# EAGLE design alim_2016 (EAGLE 7.5.0)
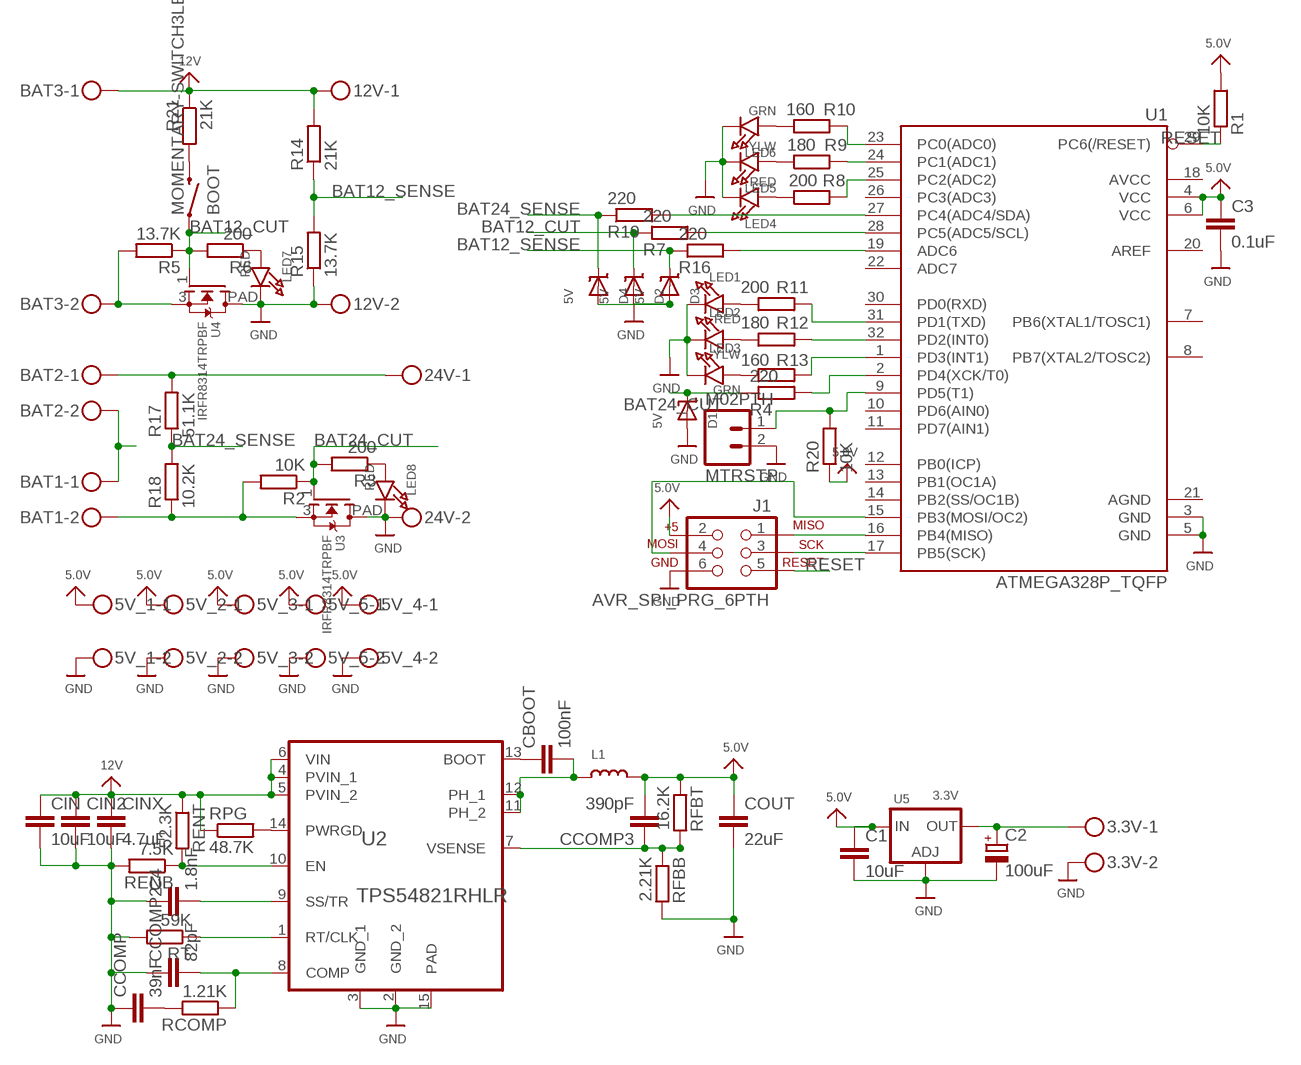
[diagram p0: schematic, sheet 1]

## Parts
3.3V  WURTH_2PIN311  [WURTH311]
5V_1  WURTH_2PIN311  [WURTH311]
5V_2  WURTH_2PIN311  [WURTH311]
5V_3  WURTH_2PIN311  [WURTH311]
5V_4  WURTH_2PIN311  [WURTH311]
5V_5  WURTH_2PIN311  [WURTH311]
12V  WURTH_2PIN311  [WURTH311]
24V  WURTH_2PIN311  [WURTH311]
BAT1  WURTH_2PIN313  [WURTH313_2]
BAT2  WURTH_2PIN313  [WURTH313_2]
BAT3  WURTH_2PIN313  [WURTH313_2]
BOOT  MOMENTARY-SWITCH3LEG  [3LEGGED-TACT]
C1  10uF  C-EUC0805  [C0805]
C2  100uF  CPOL-EUE2.5-7  [E2,5-7]
C3  0.1uF  C-EUC0805  [C0805]
C4  1.8nF  C-EUC0805  [C0805]
CBOOT  100nF  C-EUC0805  [C0805]
CCOMP  39nF  C-EUC0805  [C0805]
CCOMP2  82pF  C-EUC0805  [C0805]
CCOMP3  390pF  C-EUC0805  [C0805]
CIN  10uF  C-EUC0805  [C0805]
CIN2  10uF  C-EUC0805  [C0805]
CINX  4.7uF  C-EUC0805  [C0805]
COUT  22uF  C-EUC0805  [C0805]
D1  5V  DIODE-ZENERSOD123  [SOD-123]
D2  5V  DIODE-ZENERSOD123  [SOD-123]
D3  5V  DIODE-ZENERSOD123  [SOD-123]
D4  5V  DIODE-ZENERSOD123  [SOD-123]
J1  AVR_SPI_PRG_6PTH  [2X3]
L1  2.2uH  XAL5030  [XAL5030]
LED1  RED  LED0805_NOOUTLINE  [CHIPLED_0805_NOOUTLINE]
LED2  YLW  LED0805_NOOUTLINE  [CHIPLED_0805_NOOUTLINE]
LED3  GRN  LED0805_NOOUTLINE  [CHIPLED_0805_NOOUTLINE]
LED4  RED  LED0805_NOOUTLINE  [CHIPLED_0805_NOOUTLINE]
LED5  YLW  LED0805_NOOUTLINE  [CHIPLED_0805_NOOUTLINE]
LED6  GRN  LED0805_NOOUTLINE  [CHIPLED_0805_NOOUTLINE]
LED7  RED  LED0805_NOOUTLINE  [CHIPLED_0805_NOOUTLINE]
LED8  RED  LED0805_NOOUTLINE  [CHIPLED_0805_NOOUTLINE]
MTRSTP  M02PTH  [1X02]
R1  10K  R-EU_M0805  [M0805]
R2  10K  R-EU_M0805  [M0805]
R3  200  R-EU_M0805  [M0805]
R4  220  R-EU_M0805  [M0805]
R5  13.7K  R-EU_M0805  [M0805]
R6  200  R-EU_M0805  [M0805]
R7  220  R-EU_M0805  [M0805]
R8  200  R-EU_M0805  [M0805]
R9  180  R-EU_M0805  [M0805]
R10  160  R-EU_M0805  [M0805]
R11  200  R-EU_M0805  [M0805]
R12  180  R-EU_M0805  [M0805]
R13  160  R-EU_M0805  [M0805]
R14  21K  R-EU_M0805  [M0805]
R15  13.7K  R-EU_M0805  [M0805]
R16  220  R-EU_M0805  [M0805]
R17  51.1K  R-EU_M0805  [M0805]
R18  10.2K  R-EU_M0805  [M0805]
R19  220  R-EU_M0805  [M0805]
R20  10K  R-EU_M0805  [M0805]
R21  21K  R-EU_M0805  [M0805]
RCOMP  1.21K  R-EU_M0805  [M0805]
RENB  7.5K  R-EU_M0805  [M0805]
RENT  52.3K  R-EU_M0805  [M0805]
RFBB  2.21K  R-EU_M0805  [M0805]
RFBT  16.2K  R-EU_M0805  [M0805]
RPG  48.7K  R-EU_M0805  [M0805]
RT  59K  R-EU_M0805  [M0805]
U1  ATMEGA328P_TQFP  [TQFP32-08]
U2  TPS54821RHLR  [S-PVQFN-N14]
U3  IRFR8314TRPBF  [DPACK_1]
U4  IRFR8314TRPBF  [DPACK_1]
U5  3.3V  LM1117TO252  [TO252]

## Nets
5.0V: 5V_1.P$1 5V_2.P$1 5V_3.P$1 5V_4.P$1 5V_5.P$1 C1.1 C3.1 CCOMP3.2 COUT.1 J1.2 L1.2 R1.2 R20.1 RFBT.1 U1.4(VCC) U1.6(VCC) U5.2(IN)
12V: 12V.P$1 BAT3.P$1 CIN2.1 CIN.1 CINX.1 R14.2 R21.1 RENT.1 RPG.1 U2.4(PVIN_1) U2.5(PVIN_2) U2.6(VIN)
24V: 24V.P$1 BAT2.P$1 R17.2
BAT12_CUT: BOOT.1 D2.C R5.1 R6.2 R7.1 U4.1(G)
BAT12_SENSE: D3.C R14.1 R15.2 R16.1
BAT24_CUT: D1.C R2.1 R3.2 R4.1 U3.1(G)
BAT24_SENSE: D4.C R17.1 R18.2 R19.1
COMP: CCOMP2.2 RCOMP.1 U2.8(COMP)
EN: RENB.1 RENT.2 U2.10(EN)
GND: 3.3V.P$2 5V_1.P$2 5V_2.P$2 5V_3.P$2 5V_4.P$2 5V_5.P$2 12V.P$2 24V.P$2 C1.2 C2.- C3.2 C4.1 CCOMP2.1 CCOMP.1 CIN2.2 CIN.2 CINX.2 COUT.2 D1.A D2.A D3.A D4.A J1.6 LED1.C LED2.C LED3.C LED4.C LED5.C LED6.C LED7.C LED8.C MTRSTP.2 R15.1 RENB.2 RFBB.2 RT.2 U1.3(GND) U1.5(GND) U2.2(GND_2) U2.3(GND_1) U2.15(PAD) U3.PAD(D) U4.PAD(D) U5.1(ADJ)
MISO: J1.1 U1.16(PB4(MISO))
MOSI: J1.4 U1.15(PB3(MOSI/OC2))
N$1: 3.3V.P$1 C2.+ U5.3(OUT)
N$2: R16.2 U1.19(ADC6)
N$5: BAT1.P$1 BAT2.P$2
N$6: MTRSTP.1 R20.2 U1.9(PD5(T1))
N$7: BOOT.3 R21.2
N$8: BAT1.P$2 R2.2 R18.1 U3.3(S)
N$9: LED8.A R3.1
N$10: LED7.A R6.1
N$11: R4.2 U1.2(PD4(XCK/T0))
N$13: BAT3.P$2 R5.2 U4.3(S)
N$14: R9.2 U1.24(PC1(ADC1))
N$15: LED4.A R8.1
N$16: LED5.A R9.1
N$17: LED6.A R10.1
N$18: LED1.A R11.1
N$19: LED2.A R12.1
N$20: LED3.A R13.1
N$21: R8.2 U1.25(PC2(ADC2))
N$22: R10.2 U1.23(PC0(ADC0))
N$23: R7.2 U1.28(PC5(ADC5/SCL))
N$24: R13.2 U1.1(PD3(INT1))
N$25: R12.2 U1.32(PD2(INT0))
N$26: R11.2 U1.31(PD1(TXD))
N$28: R19.2 U1.27(PC4(ADC4/SDA))
N$30: CCOMP.2 RCOMP.2
N$31: CBOOT.1 U2.13(BOOT)
N$35: RPG.2 U2.14(PWRGD)
PH: CBOOT.2 L1.1 U2.11(PH_2) U2.12(PH_1)
RESET: J1.5 R1.1 U1.29(PC6(/RESET))
RTCLK: RT.1 U2.1(RT/CLK)
SCK: J1.3 U1.17(PB5(SCK))
SSTR: C4.2 U2.9(SS/TR)
VSENSE: CCOMP3.1 RFBB.1 RFBT.2 U2.7(VSENSE)
Unconnected: U1.7(PB6(XTAL1/TOSC1)) U1.8(PB7(XTAL2/TOSC2)) U1.10(PD6(AIN0)) U1.11(PD7(AIN1)) U1.12(PB0(ICP)) U1.13(PB1(OC1A)) U1.14(PB2(SS/OC1B)) U1.18(AVCC) U1.20(AREF) U1.21(AGND) U1.22(ADC7) U1.26(PC3(ADC3)) U1.30(PD0(RXD))

## Library data of the parts
3.3V 5V_1-5V_5 12V 24V BAT1-BAT3 = alim:WURTH_2PIN
BOOT = alim:MOMENTARY-SWITCH: Various NO switches- pushbuttons, reed, etc
C1 C3 C4 CBOOT CCOMP CCOMP2 CCOMP3 CIN CIN2 CINX COUT = rcl:C-EU: CAPACITOR, European symbol
C2 = rcl:CPOL-EU: POLARIZED CAPACITOR, European symbol
D1-D4 = alim:DIODE-ZENER: Zener Diode SMA: 30V 1W Zener Diode, 1.2Vf - Digikey: SMAZ30-FDICT-ND
J1 = SparkFun-Connectors:AVR_SPI_PRG_6: AVR ISP 6 Pin This is the reduced ISP connector for AVR programming. Common on Arduino. This footprint will take up less PCB space and can be used with a 10-pin to 6-pin adapter such as SKU: BOB-08508
L1 = alim:XAL5030
LED1-LED8 = microbuilder:LED: LED 0603 - 0603 Surface Mount Package 2mA: Green LED - Low Power (3.9mcd, 2ma, 1.7Vf) - Digikey: 475-2709-2-ND Orange LED - Low Power (9.8mcd, 2ma, 1.8Vf) - Digikey: 475-1194-2-ND Red LED - Low Power (5mcd, 2ma, 1.8Vf) - Digikey: 475-1195-2-ND Yellow LED - Low Power (7mcd, 2ma, 1.8Vf) - Digikey: 475-1196-2-ND 5mA: Blue LED - Low Power (17mcd, 5ma, 2.9Vf) - Digikey: LNJ937W8CRACT-ND 0805 - 0805 Surface Mount Package 2mA: Red LED (8.8mcd, 2mA, 1.8Vf, Clear) - Low Power [Digikey: 475-2510-1-ND] Green LED (5mcd, 2mA, 1.8Vf, Clear) - Low Power [Digikey: 475-2730-1-ND] Yellow LED (11.3mcd, 2mA, 1.8Vf, Clear) - Low Power [Digikey: 475-2555-1-ND] 20mA: Red LED (104mcd, 20mA, Diffused) - LS R976 [Digikey: 475-1278-6-ND] Red LED (12mcd, 20mA, 2.0Vf, Clear) - APT2012EC [Digikey: 754-1128-1-ND] Green LED (15mcd, 20mA, 2.2Vf, Clear) - APT2012GC [Digikey: 754-1131-1-ND] Orange LED (160mcd, 20mA, 2.1Vf, Clear) - APT2012SECK [Digikey: 754-1130-1-ND] 1206 - 1206 Surface Mount Package Green LED (26mcd, 20mA, Diffused) - LG N971 [Digikey: 475-1407-6-ND] Red LED (15mcd, 20mA, Diffused) - LH N974 [Digikey: 475-1416-6-ND]
MTRSTP = SparkFun-Connectors:M02: Standard 2-pin 0.1" header. Use with - straight break away headers ( PRT-00116) - right angle break away headers (PRT-00553) - swiss pins (PRT-00743) - machine pins (PRT-00117) - female headers (PRT-00115) Molex polarized connector foot print use with: PRT-08233 with associated crimp pins and housings. 2.54_SCREWTERM for use with PRT-10571. 3.5mm Screw Terminal footprints for PRT-08084 5mm Screw Terminal footprints for use with PRT-08433
R1-R21 RCOMP RENB RENT RFBB RFBT RPG RT = resistor:R-EU_: RESISTOR, European symbol
U1 = SparkFun-DigitalIC:ATMEGA328P_TQFP; PROD_ID: IC-09069
U2 = alim:TPS54821RHLR; DATASHEETURL: http://www.ti.com/product/tps54821; FREQUENCY: 1600000.0; IMAX: 8.0; MANUFACTURER_NAME: Texas Instruments; MANUFACTURER_PART_NUMBER: TPS54821RHLR; MKTG_PACKAGE: S-PVQFN-N14; NSID: TPS54821RHLR; PACKAGE: S-PVQFN-N14; VENDOR: Texas Instruments
U3 U4 = alim:IRFR8314TRPBF
U5 = microbuilder:LM1117: LM1117 Voltage Regulator LM1117 Adjustable Voltage regulator [Digikey: LM1117IMP-ADJDKR-ND] LM1117 3.3V Voltage regulator [AP1117E33GDIDKR-ND] LM1117 5.0V Voltage regulator [AP1117E50GDIDKR-ND] SOT223-REFLOW - SOT223 package for solder paste/reflow ovens SOT223-WAVE - SOT223 package for hand-soldering (larger pads) Note: For the fixed-voltage regulators, simply set the ADJ pin to GND.

## Board
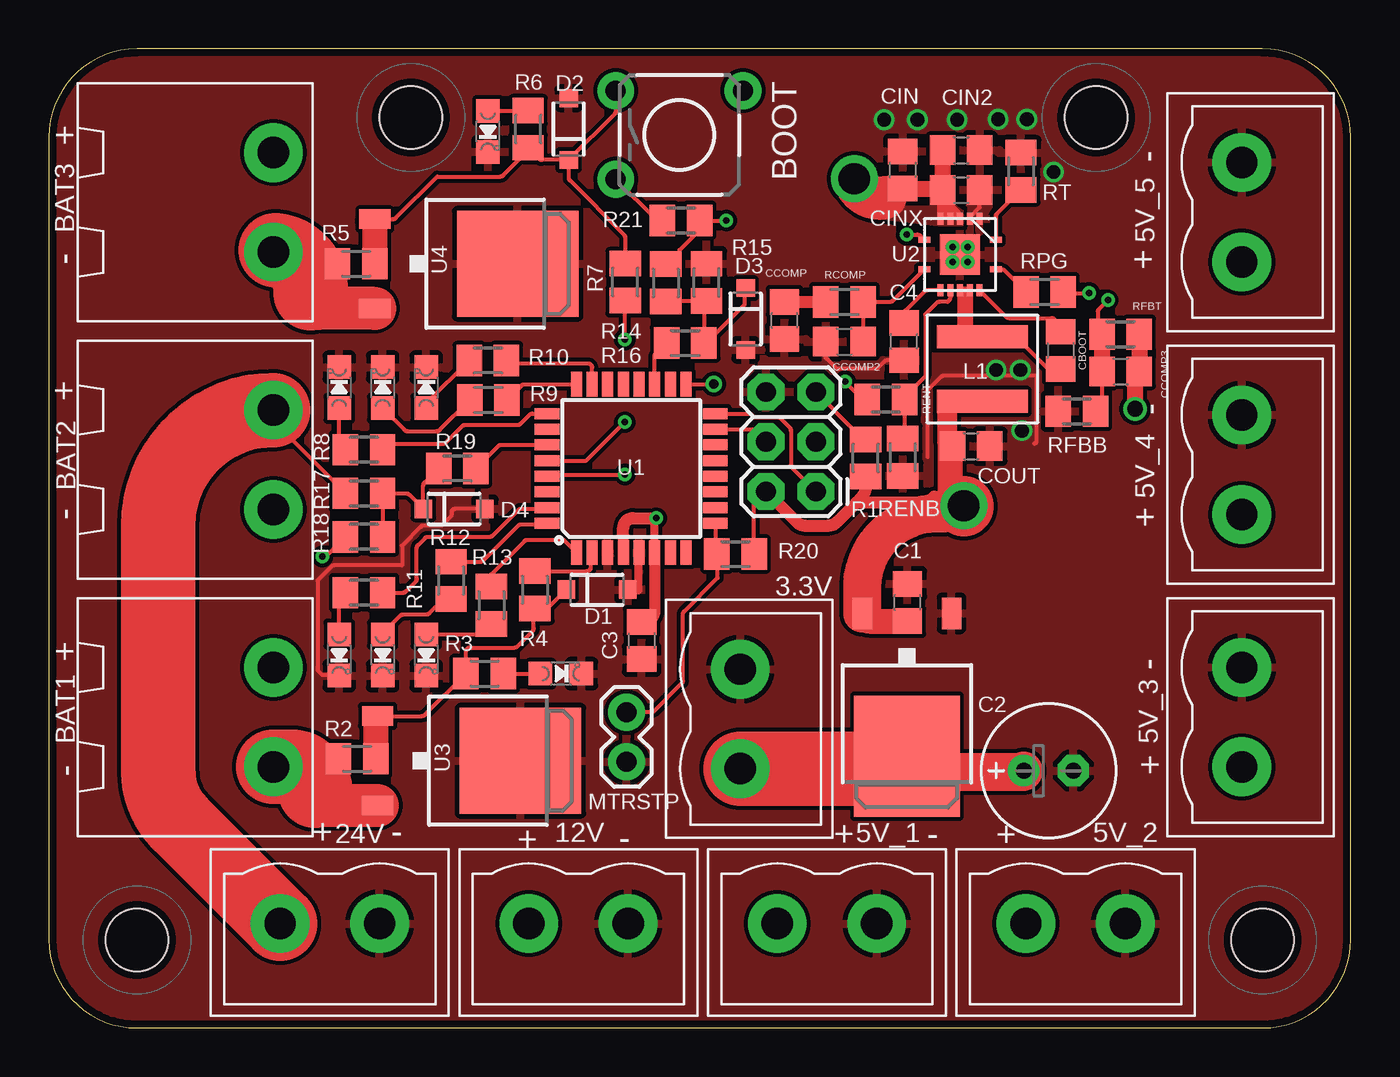
[diagram p1: board, top side]
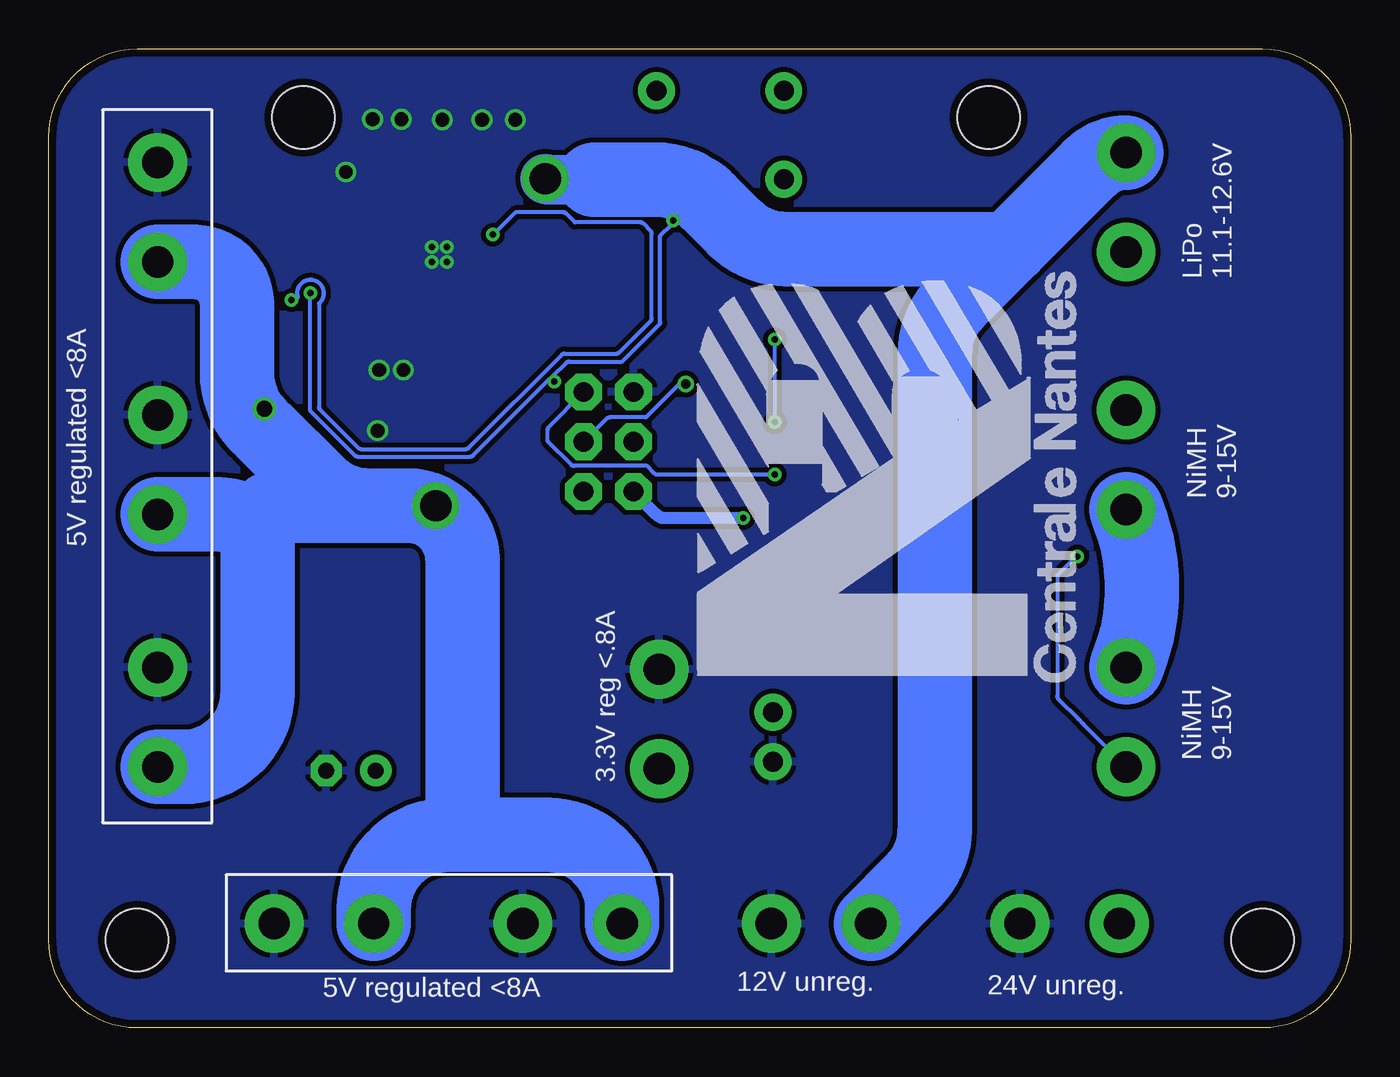
[diagram p2: board, bottom side, seen from below]

Size 66.5 x 50 mm. Coordinates in mm from the lower left corner, seen from the top.
Outline: 4.5,50 arc90 0,45.5 0,4.5 arc90 4.5,0 62,0 arc90 66.5,4.5 66.5,45.5 arc90 62,50 4.5,50
Copper layers (1*16): Top 0.0356mm / dielectric 1.5011mm / Bottom 0.0356mm
Design rules "oshpark *": minimum track width 6mil, minimum drill 13mil, track to track 6mil, track to pad 6mil, pad to pad 6mil, via to via 6mil, smd to smd 6mil, copper to edge 15mil, drill to drill 6mil, minimum pad ring 7mil, minimum via ring 7mil, stop-mask expansion 3mil, vias tented up to drill 35mil, thermal gap 10mil
Holes 3.2 mm at 4.5,4.5 62,4.5 53.5,46.5 18.5,46.5

### Footprints (pad centres in the part's own frame; a part is rotated, then mirrored left to right if it is on the bottom)
WURTH311 = drill 1.6 pad 3: P$1 -2.54,0; P$2 2.54,0
WURTH313_2 = drill 1.6 pad 3: P$1 -2.54,0; P$2 2.54,0
3LEGGED-TACT = drill 1.016 pad 1.88: 1 -3.251,2.261; 2 3.251,2.261; 3 -3.251,-2.261
C0805 = smd 1.3 x 1.5: 1 -0.95,0; 2 0.95,0
E2,5-7 = drill 0.813 pad 1.6: + -1.27,0 | drill 0.813 pad 1.6 octagon: - 1.27,0
SOD-123 = smd 0.9 x 0.95: A 1.575,0; C -1.575,0
2X3 = drill 1.016 pad 1.88 octagon: 1 0,0; 2 0,2.54; 3 2.54,0; 4 2.54,2.54; 5 5.08,0; 6 5.08,2.54
XAL5030 = smd 1.168 x 4.648: 1 -1.651,0; 2 1.651,0
CHIPLED_0805_NOOUTLINE = smd 1.2 x 1.2: A 0,-1.05; C 0,1.05
1X02 = drill 1.016 pad 1.88: 1 0,0; 2 2.54,0
M0805 = smd 1.3 x 1.6: 1 -0.95,0; 2 0.95,0
TQFP32-08 = smd 1.27 x 0.559: 1 -4.293,2.8; 2 -4.293,2; 3 -4.293,1.2; 4 -4.293,0.4; 5 -4.293,-0.4; 6 -4.293,-1.2; 7 -4.293,-2; 8 -4.293,-2.8; 17 4.293,-2.8; 18 4.293,-2; 19 4.293,-1.2; 20 4.293,-0.4; 21 4.293,0.4; 22 4.293,1.2; 23 4.293,2; 24 4.293,2.8 | smd 0.559 x 1.27: 9 -2.8,-4.293; 10 -2,-4.293; 11 -1.2,-4.293; 12 -0.4,-4.293; 13 0.4,-4.293; 14 1.2,-4.293; 15 2,-4.293; 16 2.8,-4.293; 25 2.8,4.293; 26 2,4.293; 27 1.2,4.293; 28 0.4,4.293; 29 -0.4,4.293; 30 -1.2,4.293; 31 -2,4.293; 32 -2.8,4.293
S-PVQFN-N14 = smd 0.305 x 0.61: 1 -0.75,1.825; 7 -0.75,-1.825; 8 0.75,-1.825; 14 0.75,1.825 | smd 0.61 x 0.305: 2 -1.825,1; 3 -1.825,0.5; 4 -1.825,0; 5 -1.825,-0.5; 6 -1.825,-1; 9 1.825,-1; 10 1.825,-0.5; 11 1.825,0; 12 1.825,0.5; 13 1.825,1 | smd 2.057 x 2.057: 15 0,0
DPACK_1 = smd 1 x 1.6: 1 -2.28,-4.8; 3 2.28,-4.8 | smd 5.4 x 6.2: PAD 0,2.5
TO252 = smd 1 x 1.6: 1 -2.28,-4.8; 2 2.28,-4.8 | smd 5.4 x 6.2: 3 0,2.5

### Placement (x,y rotation side)
3.3V  35.32,15.78 90 top
5V_1  39.75,5.33 0 top
5V_2  52.45,5.33 0 top
5V_3  60.95,15.88 90 top
5V_4  60.95,28.77 90 top
5V_5  60.95,41.66 90 top
12V  27.05,5.33 0 top
24V  14.35,5.33 0 top
BAT1  11.46,15.88 270 top
BAT2  11.46,29.02 270 top
BAT3  11.46,42.16 270 top
BOOT  32.21,45.61 0 top
C1  43.86,21.73 90 top
C2  51.07,13.14 0 top
C3  30.28,19.79 270 top
C4  43.69,35.05 90 top
CBOOT  51.69,34.61 270 top
CCOMP  37.58,36.13 90 top
CCOMP2  40.64,35.05 0 top
CCOMP3  54.75,33.53 0 top
CIN  43.62,43.81 90 top
CIN2  46.61,44.83 0 top
CINX  46.61,42.8 0 top
COUT  47.12,29.72 0 top
D1  28,22.38 0 top
D2  26.55,45.9 90 top
D3  35.59,36.21 270 top
D4  20.7,26.51 0 top
J1  39.18,27.4 90 top
L1  47.69,33.66 270 top
LED1  14.83,19.05 180 top
LED2  17.05,19.05 180 top
LED3  19.27,19.05 180 top
LED4  14.83,32.7 0 top
LED5  17.05,32.7 0 top
LED6  19.27,32.7 0 top
LED7  22.42,45.79 180 top
LED8  26.16,18.1 270 top
MTRSTP  29.51,16.13 270 top
R1  41.72,29.11 270 top
R2  15.75,13.75 180 top
R3  22.26,18.1 180 top
R4  24.83,22.38 90 top
R5  15.7,39.03 180 top
R6  24.48,45.9 270 top
R7  29.44,38.09 270 top
R8  16.1,29.53 0 top
R9  22.45,32.07 0 top
R10  22.42,34.09 0 top
R11  16.1,22.23 0 top
R12  20.54,22.86 90 top
R13  22.61,21.59 90 top
R14  31.52,38.06 90 top
R15  33.59,38.08 270 top
R16  32.51,34.98 180 top
R17  16.1,27.3 180 top
R18  16.1,25.08 0 top
R19  20.86,28.57 0 top
R20  35.08,24.21 180 top
R21  32.29,41.24 180 top
RCOMP  40.64,37.08 180 top
RENB  43.62,29.15 270 top
RENT  42.76,32.09 0 top
RFBB  52.51,31.5 180 top
RFBT  54.75,35.43 180 top
RPG  50.86,37.59 180 top
RT  49.66,43.75 90 top
U1  29.75,28.57 90 top
U2  46.55,39.5 270 top
U3  21.59,13.65 270 top
U4  21.45,39.03 270 top
U5  43.83,16.38 180 top

### Tracks (layer width: path | path; a pad name or v marks a point on that pad's centre or on a via)
5.0V  (via drill 0.33, 0.8, 1.6)
  Top 0.203: 45.88,29.77 arc45 46.02,29.83 arc-45 46.09,29.8 COUT.1 | 45.23,27.13 45.47,27.13 arc45 45.61,27.19 | 45.61,27.19 45.98,27.56 arc45 46.04,27.71 46.04,26.06 | 45.84,30.27 arc-45 45.88,30.26 45.91,30.23 | R20.1 36.03,26.7 arc-45 36.09,26.85 J1.2 | 45.61,27.19 45.61,26.78 arc90 45.85,26.54 46.61,26.54 arc90 v46.74,26.67 | 55.5,35.73 55.5,35.7 arc45 55.56,35.55 55.72,35.4 | 55.72,35.4 55.75,35.36 | RFBT.1 RFBT.1 arc45 55.72,35.4
  Top 0.406: 29.34,25.54 arc-90 29.35,25.55 | U1.6 30.95,25.87 arc-45 v31.02,26.04 | v46.74,26.66 v46.74,26.67
  Top 0.559: U1.4 29.35,25.55 | U1.6 30.95,21.3 arc-90 30.39,20.74 C3.1
  Top 0.61: 29.34,25.15 29.34,25.54 | 29.35,25.55 arc-90 29.83,26.04 v31.02,26.04 | J1.2 38.21,25.83 arc45 38.64,25.65 39.82,25.65 arc45 40.25,25.83 41.24,26.83 | 41.24,26.83 41.54,27.13 arc45 41.72,27.56 R1.2 | 45.84,30.27 arc45 46.04,29.84 | 45.23,27.13 arc-45 44.55,26.83 41.24,26.83
  Top 0.813: 47.82,31.88 L1.2 | RFBT.1 CCOMP3.2 arc-45 55.5,33.52 v55.5,31.62
  Top 1.016: COUT.1 arc-45 45.91,29.85 45.91,30.23 45.91,32 L1.2
  Top 1.27: 46.04,29.84 46.04,26.06 | U5.2 arc90 41.94,20.78 C1.1
  Top 1.93: 45.85,26.54 45.85,26.29 45.36,26.29 arc90 41.55,22.48 U5.2
  Top 3.048: v46.74,26.66 arc45 46.75,26.63
  Bottom 0.203: 46.1,9.87 46.1,10.43 arc90 45.98,10.55 45.98,12.87 | v46.74,26.67 48.13,26.67 | v55.5,31.62 55.5,31.13 arc45 55.56,30.98 55.78,30.76
  Bottom 0.61: v31.02,26.04 35.02,26.04 arc45 35.45,26.21 J1.2
  Bottom 0.813: 55.5,30.1 55.5,30.48
  Bottom 2.184: 46.03,12.91 arc90 45.98,12.87
  Bottom 3.81: 5V_1.P$1 37.21,6.06 arc-90 41.02,9.87 45.38,9.87 | 45.38,9.87 46.1,9.87 arc-90 49.91,6.06 5V_2.P$1 | 55.84,25.4 arc90 54.57,26.67 50.11,26.67 | 45.38,9.87 45.38,23.91 arc-90 48.13,26.67 50.11,26.67 | 5V_5.P$1 59.06,39.12 arc90 56.9,36.96 56.9,33.45 arc-45 55.78,30.76 55.5,30.48 52.8,27.79 arc-45 50.11,26.67 | 5V_4.P$1 57.85,26.23 arc45 55.84,25.4 | 5V_3.P$1 59.65,13.34 arc-90 55.84,17.14 55.84,25.4
12V  (via drill 0.33, 1.6)
  Top 0.203: U2.4 46.55,41.45 arc45 46.49,41.65 45.97,42.16 45.97,41.99 arc45 46.03,42.1 46.35,41.78 46.35,41.53 arc45 46.31,41.64 46.1,41.85 46.1,41.68 arc45 46.16,41.53 46.23,41.47 arc45 46.18,41.57 45.78,41.97 45.83,41.97 arc-45 45.97,41.91 45.97,41.91 arc45 45.87,41.87 45.78,41.78 45.78,41.59 45.85,41.66 45.97,41.53 arc45 45.87,41.48 45.85,41.47 45.72,41.47 45.72,42.04 | 41.66,32.51 arc-45 41.72,32.36 41.72,32.01 arc45 41.78,31.87 41.78,32.02 arc-45 RENT.1 arc45 41.79,31.9 v40.68,33.01 40.8,32.88 | RPG.1 RPG.1 arc45 51.96,37.53 v53.15,37.53 | 33.24,40.81 arc-45 33.18,40.67 arc45 33.12,40.64 32.21,39.73 32.21,39.59 arc-45 32.16,39.47 32.07,39.47 arc45 31.93,39.41 R14.2 | 33.24,40.81 R21.1 | 33.24,40.81 33.61,41.18 arc-45 33.75,41.24 v34.61,41.24
  Top 0.305: U2.6 45.55,42.69 CINX.1
  Top 0.813: CIN2.1 CINX.1 CINX.1 arc45 45.51,42.87 CIN.1 arc90 43.5,42.74 43.14,42.74 arc45 43,42.68 42.74,42.42
  Top 2.184: v41.15,43.37 arc90 42.74,42.42
  Bottom 0.203: v53.15,37.53 53.15,31.52 50.87,29.24 arc-45 50.73,29.18 44.97,29.18 arc-45 44.82,29.24 40.89,33.18 40.74,33.03 arc-45 v40.68,33.01 40.71,33.04 arc45 40.77,33.18 40.77,33.27 40.06,33.98 arc45 39.92,34.04 37.21,34.04 35.33,35.92 arc-45 35.27,36.06 35.27,40.45 34.67,41.04 arc-45 34.61,41.19 v34.61,41.24 33.88,41.24 arc-45 33.74,41.3 32.82,42.22
  Bottom 2.54: 41.16,43.37 v41.15,43.37 arc-45 41.06,43.33 38.66,43.33
  Bottom 3.81: 12V.P$1 22.35,7.5 arc-45 21.23,10.19 21.23,34.44 arc45 20.12,37.13 17.27,39.98 | BAT3.P$1 arc-45 13.31,43.94 17.27,39.98 | 17.27,39.98 arc45 17.76,39.78 28.8,39.78 arc45 31.49,40.89 32.82,42.22 arc-45 35.51,43.33 38.66,43.33
  pour Top (no thermals): 45.47,41.1 46.62,41.1 46.62,41.64 46.14,41.99 45.95,42.75 45.31,43.35 45.16,41.91 arc-90 45.1,41.85 43.66,41.85 42.37,41.45
24V
  Top 0.203: R17.2 11.52,30.93 arc-45 11.46,31.07 BAT2.P$1
  Top 3.81: 24V.P$1 6.7,10.44 arc-45 5.59,13.13 5.59,25.69 arc-90 BAT2.P$1
BAT12_CUT
  Top 0.203: R7.1 29.44,40.38 arc45 29.38,40.52 26.61,43.29 arc-45 26.55,43.43 D2.C | D2.C 25.19,44.33 arc-45 25.05,44.39 R6.2 24.11,44.58 arc45 24.05,44.44 24.05,44.39 23.2,43.54 arc-45 23.06,43.48 19.84,43.48 17.72,41.37 arc-45 17.58,41.31 U4.1 16.65,41.01 arc-45 16.65,41 | BOOT.1 28.96,46.82 arc-45 28.9,46.67 D2.C
  Top 0.813: 16.24,41.21 arc-90 16.65,41
  Top 1.27: 16.65,41 R5.1
BAT12_SENSE
  Top 0.203: 35.44,38.02 arc45 35.5,37.88 D3.C arc45 35.56,37.88 35.56,36.96 33.87,35.27 arc-45 33.73,35.21 arc45 33.66,35.18 R16.1 33.46,36.92 | R15.2 33.52,37.06 arc45 33.46,36.92 | 33.46,36.92 33.33,37.05 arc45 33.19,37.11 R14.1
BAT24_CUT
  Top 0.203: D1.C 25.54,21.49 arc-45 25.39,21.43 R4.1 R4.1 arc45 24.77,21.29 24.77,20.4 arc-45 24.7,20.26 23.94,19.49 arc-45 23.79,19.43 21.51,19.43 arc90 21.31,19.23 R3.2 19.2,15.99 arc-45 19.06,15.93 U3.1 arc90 16.7,15.84 16.7,15.71 | D1.C arc45 26.46,22.31 arc-45 D1.C
  Top 1.27: 16.7,15.71 R2.1
BAT24_SENSE
  Top 0.203: R19.1 19.19,27.85 arc45 19.13,27.71 D4.C 18.39,27.25 arc45 18.25,27.3 R17.1 R18.2
COMP
  Top 0.203: CCOMP2.2 RCOMP.1 42.97,37.08 arc45 43.12,37.14 U2.8
EN
  Top 0.203: U2.10 46.05,37.3 arc-45 45.99,37.16 45.91,37.08 45.49,37.08 arc45 45.34,37.02 44.77,36.45 44.77,33.29 43.77,32.29 arc45 RENT.2 43.71,30.2 arc45 RENB.1
GND  (via drill 0.33, 0.7)
  Top 0.203: C4.1 42.82,34.1 arc45 42.68,34.04 42.29,33.66 40.34,33.66 arc-45 40.2,33.72 39.69,34.23 CCOMP2.1 arc-45 CCOMP2.1 | 44.9,29.17 44.9,31.18 arc-45 44.87,31.24 44.87,32.56 45.55,33.24 arc-45 45.69,33.3 50.47,33.3 50.47,29.97 arc-90 50.44,29.95 arc-90 50.34,29.84 | U2.3 47.05,41.41 47.55,41.91 47.55,42.79 CINX.2 | 44.07,28.65 RENB.2 | D4.A 20.75,26.51 arc45 20.61,26.45 20.57,26.42 20.57,26.25 arc-45 20.51,26.1 20.07,25.65 19.13,25.65 arc45 18.99,25.59 18.03,24.64 18.03,23.62 14.56,23.62 arc45 14.42,23.56 13.72,22.86 13.72,18.37 arc45 13.78,18.23 13.97,18.03 14.74,18.03 arc-45 LED1.C
  Top 0.406: U1.5 arc90 30.1,24.23 30.1,22.35 arc90 30.07,22.38 D1.A
  other vias: 46.93,39.88 46.16,39.88 46.16,39.12 46.93,39.12 42.67,46.38 44.37,46.38 46.41,46.38 48.49,46.41 49.96,46.41 51.33,43.71 48.39,33.6 49.63,33.6 49.71,30.51
  pour Top (isolate 0.203, rank 4): 62,0 4.5,0 arc-90 0,4.5 0,45.5 arc-90 4.5,50 62,50 arc-90 66.5,45.5 66.5,4.5 arc-90
  pour Bottom (isolate 0.254, rank 2): 62,0 4.5,0 arc-90 0,4.5 0,45.5 arc-90 4.5,50 62,50 arc-90 66.5,45.5 66.5,4.5 arc-90
  pour Top (rank 3, no thermals): 47.02,42.19 48.11,42.19 48.11,41.92 47.62,41.12 47,41.12 47.02,42.18
MISO
  Top 0.203: U1.16 35.79,31.38 arc-45 35.93,31.32 36.07,31.18 37.25,31.18 arc-45 37.4,31.12 37.85,30.67 arc-45 37.91,30.52 37.91,28.75 arc45 37.97,28.61 J1.1
MOSI
  Top 0.203: U1.15 35.92,30.57 arc-45 36.06,30.52 J1.4
N$1
  Top 0.203: 44.16,13.24 43.96,13.24 arc90 U5.3
  Top 1.93: 44.32,13.08 49.74,13.08 arc90 C2.+
  Top 3.81: 3.3V.P$1 44.16,13.24 arc-90 44.32,13.08
N$2
  Top 0.203: U1.19 30.95,34.37 R16.2
N$5
  Bottom 0.203: BAT1.P$1 | BAT2.P$2
  Bottom 3.81: BAT1.P$1 arc-45 BAT2.P$2
N$6
  Top 0.203: U1.9 34.04,24.38 arc45 34.1,24.23 R20.2 arc-45 34.16,24.12 34.16,22.99 32.45,21.27 arc45 32.38,21.12 32.38,17.74 arc-45 32.33,17.59 30.86,16.13 MTRSTP.1 30.14,16.13 arc45 30.29,16.19
N$7
  Top 0.203: BOOT.3 31,41.3 arc45 31.15,41.24 R21.2
N$8  (via drill 0.33)
  Top 0.203: R18.1 | 13.75,11.37 13.66,11.46 arc-45 13.6,11.6 13.6,12.12 13.6,13.54 arc-90 13.8,13.75 R2.2 | R18.1 15.06,25.08 arc45 14.91,25.02 | v13.97,24.08 14.06,24.08 arc45 14.2,24.14 R18.1
  Top 2.184: 13.75,11.37 U3.3
  Top 3.81: 13.6,12.12 arc90 12.38,13.34 BAT1.P$2
  Bottom 0.203: BAT1.P$2 13.67,15.54 13.91,15.78 14.93,16.8 arc45 14.99,16.94 14.99,23.11 14.06,24.04 arc45 v13.97,24.08
N$9
  Top 0.203: R3.1 LED8.A
N$10
  Top 0.203: LED7.A 24.47,46.84 arc90 R6.1
N$11
  Top 0.203: 27.84,24.19 U1.2 27.69,24.22 27.69,23.54 arc-90 27.48,23.33 R4.2
N$13
  Top 0.203: 13.56,38.92 arc90 13.36,38.72 | R5.2 13.75,39.03 arc45 13.61,38.97 13.36,38.72 | 13.36,38.72 13.36,37.52 13.36,37.24 | 13.36,37.24 13.36,36.87 arc45 13.41,36.75 | 13.36,37.24 arc45 13.42,37.09 13.77,36.75
  Top 0.406: BAT3.P$2 11.58,39.62 11.58,39.73
  Top 2.184: U4.3 13.77,36.75 13.41,36.75
  Top 3.81: 11.58,39.73 arc-90 13.36,37.52
N$14
  Top 0.203: R9.2 24.14,32.81 arc-45 24.28,32.87 U1.24
N$15
  Top 0.203: R8.1 14.83,29.85 LED4.A
N$16
  Top 0.203: LED5.A 18.16,30.54 arc45 18.31,30.48 19.82,30.48 arc45 19.97,30.54 R9.1
N$17
  Top 0.203: 21.27,33.75 arc90 21.47,33.96 R10.1 19.33,31.95 arc45 19.27,31.8 LED6.A
N$18
  Top 0.203: LED1.A 14.83,21.82 arc-45 14.89,21.96 R11.1
N$19
  Top 0.203: LED2.A 17.05,20.16 17.94,21.05 arc-45 18.09,21.11 19.28,21.11 arc45 19.42,21.17 20.1,21.85 arc-45 20.24,21.91 R12.1
N$20
  Top 0.203: LED3.A 21.91,20.1 22.39,20.58 arc-45 22.53,20.64 R13.1
N$21
  Top 0.203: R8.2 17.36,29.84 20.14,29.84 arc45 20.28,29.91 21.12,30.74 arc-45 21.26,30.8 23.95,30.8 arc45 24.09,30.86 24.55,31.32 arc-45 24.7,31.38 U1.25
N$22
  Top 0.203: U1.23 27.75,33.73 arc90 27.55,33.93 23.52,33.93 arc-90 R10.2
N$23  (via drill 0.33 pad 0.2)
  Top 0.203: R7.2 arc45 29.41,37.08 v29.41,35.15 | U1.28 27.45,28.98 v29.41,30.94
  Bottom 0.203: v29.41,30.94 v29.41,35.15
N$24
  Top 0.203: R13.2 22.61,23.18 24.29,24.86 arc-45 24.44,24.92 26.22,24.92 arc-45 26.37,24.86 U1.1
N$25
  Top 0.203: R12.2 22.04,23.81 arc45 22.19,23.87 23.98,25.66 arc-45 24.12,25.72 25.4,25.72 U1.32
N$26
  Top 0.203: R11.2 18.08,22.23 arc45 18.22,22.29 18.74,22.8 arc45 18.8,22.94 18.8,24.52 arc-45 18.86,24.67 19.21,25.02 arc-45 19.36,25.08 22.52,25.08 arc45 22.67,25.14 23.98,26.45 arc-45 24.12,26.51 25.39,26.51 U1.31
N$28
  Top 0.203: R19.2 22.95,29.71 arc-45 23.09,29.77 U1.27
N$30
  Top 0.203: RCOMP.2 arc-45 RCOMP.2
  Top 0.61: CCOMP.2 RCOMP.2 arc45 RCOMP.2
N$31
  Top 0.203: U2.13 48.9,36.32 arc45 49.04,36.26 51.22,36.26 arc-45 51.37,36.2 51.5,36.06 arc-45 51.56,35.92 51.56,35.11 51.63,35.18 arc45 51.69,35.32 CBOOT.1
  Top 0.305: U2.13 47.55,37.61
N$35
  Top 0.203: U2.14 48.67,38.75 arc-45 48.82,38.69 RPG.2
PH
  Top 0.203: CBOOT.2 51.14,33.66 arc-45 50.99,33.72 49.78,34.92 48.73,34.92 arc-45 48.58,34.98 48.39,35.18 47.9,35.18 arc-45 47.76,35.24 L1.1 | U2.12 47.05,37.48 arc45 47.05,37.47
  Top 0.305: U2.12 U2.11 | 47.05,37.47 46.8,37.47
  Top 0.813: 46.8,37.47 46.8,35.63 arc45 46.86,35.49 46.98,35.37 47.54,35.37 arc-45 L1.1
RESET  (via drill 0.33)
  Top 0.203: U1.29 25.38,28.26 v29.41,28.26 | J1.5 40.96,30.7 arc-45 41.02,30.55 41.02,30.1 41.64,30.1 arc-45 R1.1
  Bottom 0.203: v29.41,28.26 35.41,28.26 arc45 35.56,28.32 35.94,28.7 39.67,28.7 arc45 39.81,28.76 41.02,29.97 41.02,30.55 arc45 40.96,30.7 J1.5
RTCLK
  Top 0.203: 48.41,40.34 arc45 U2.1 48.37,41.43 arc-45 48.43,41.58 RT.1
SCK  (via drill 0.49)
  Top 0.203: U1.17 33.91,32.87 arc45 v33.97,32.89
  Bottom 0.203: v33.97,32.89 34.21,32.89 arc-45 34.35,32.83 36.01,31.18 37.86,31.18 arc-45 38,31.12 J1.3
SSTR
  Top 0.203: U2.9 44.87,37.67 arc45 44.72,37.61 43.75,36.64 43.75,36.15 arc-45 C4.2
VSENSE  (via drill 0.33)
  Top 0.203: v43.81,40.51 44.37,40.51 arc-45 44.51,40.45 U2.7 | RFBT.2 arc-45 53.59,35.44 53.59,36.58 arc-45 53.65,36.72 v54.1,37.17 | 53.54,31.7 arc45 53.6,31.84 53.6,31.71 arc-45 53.54,31.57 RFBB.1 53.74,31.77 arc45 53.8,31.91 CCOMP3.1
  Top 0.813: RFBT.2 CCOMP3.1
  Bottom 0.203: v54.1,37.17 54,37.17 arc-45 53.86,37.23 53.78,37.3 arc250 52.7,36.99 52.7,31.72 arc-45 52.65,31.58 50.69,29.62 arc-45 50.55,29.57 45.2,29.57 arc-45 45.05,29.62 40.29,34.38 arc45 40.15,34.44 37.5,34.44 arc-45 37.35,34.5 35.77,36.09 arc-45 35.71,36.23 35.71,40.58 arc-45 35.77,40.73 36.13,41.09 arc-45 36.28,41.15 39.62,41.15 40.07,41.6 arc-45 40.22,41.66 42.67,41.66 v43.81,40.51

### Text on the board
tNames: + | - | - | + | + | - | - | + | + | - | - | + | + | - | + | - | + | - | +
bNames: LiPo / 11.1-12.6V | 5V regulated <8A | NiMH / 9-15V | 3.3V reg <.8A | NiMH / 9-15V | 24V unreg. | 12V unreg. | 5V regulated <8A
tStop: NantRobot | Carte alim | 2015-2016